# Altium schematic sheet [4] PWM, MOSFETs.SchDoc
size A4; DocumentNumber: 3; SheetNumber: 3; SheetTotal: 10
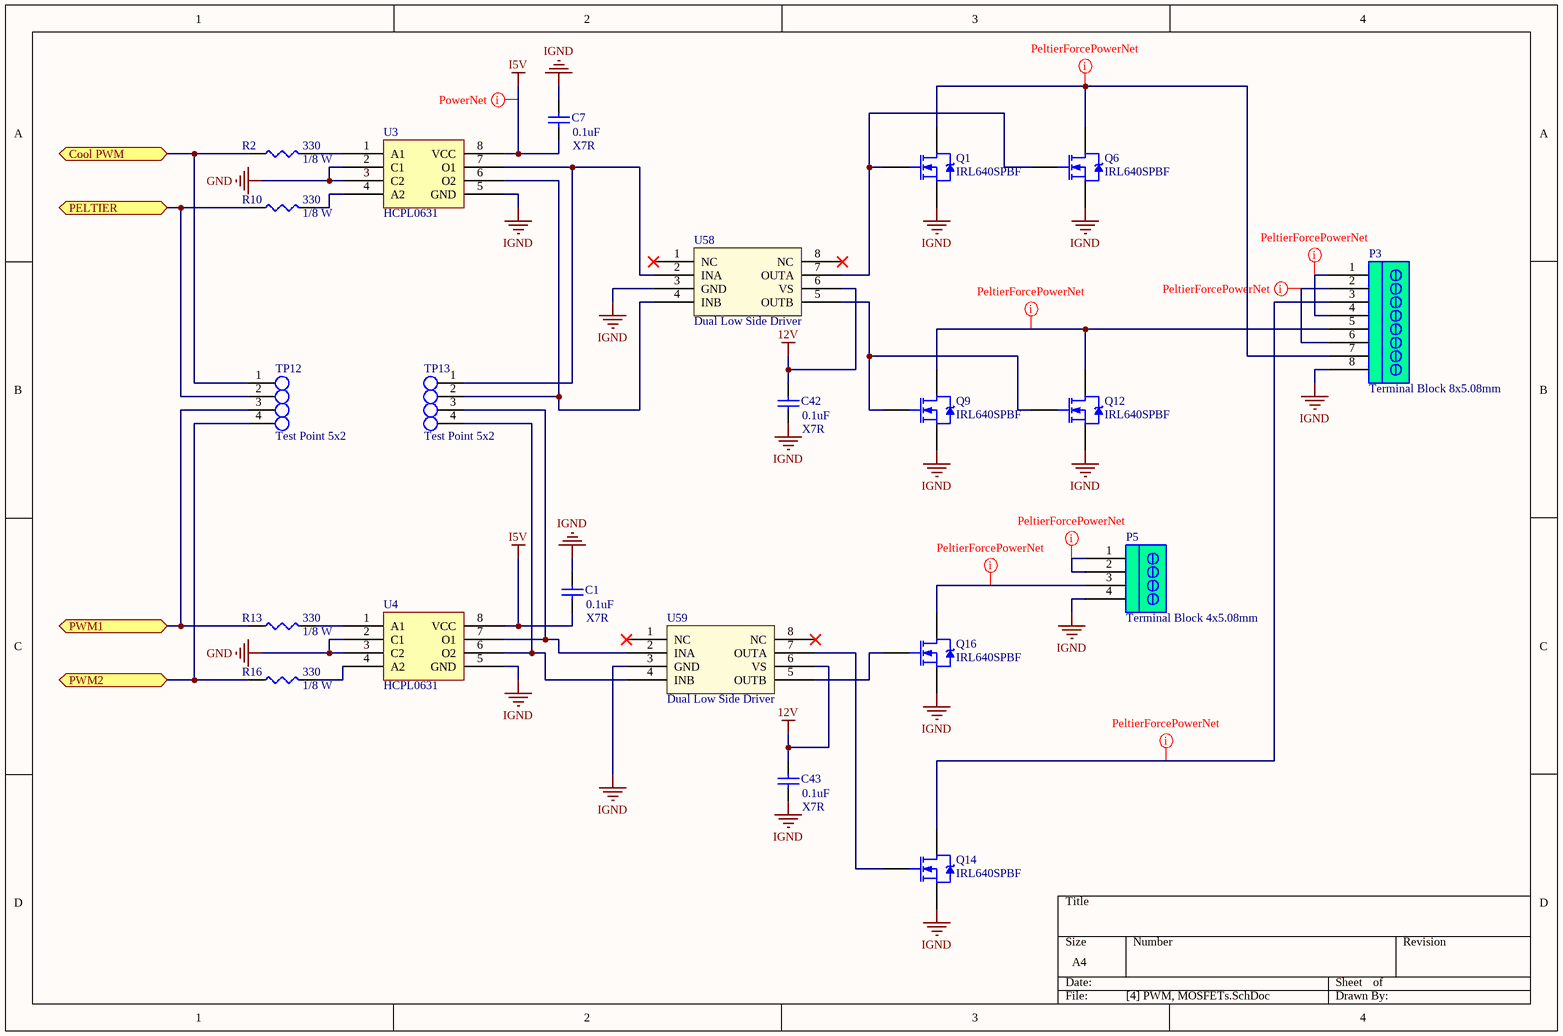
[diagram p0: [4] PWM, MOSFETs.SchDoc]

## Parts
C1  value 0.1uF  Type: X7R  [CAP0805]  (hidden comment: CAP0805 0.1uF X7R)
C7  value 0.1uF  Type: X7R  [CAP0805]  (hidden comment: CAP0805 0.1uF X7R)
C42  value 0.1uF  Type: X7R  [CAP0805]  (hidden comment: CAP0805 0.1uF X7R)
C43  value 0.1uF  Type: X7R  [CAP0805]  (hidden comment: CAP0805 0.1uF X7R)
P3  Terminal Block 8x5.08mm  [SOCKET 8x5.08]
P5  Terminal Block 4x5.08mm  [Socket 4x5.08]
Q1  IRL640SPBF  [TO-263AB]
Q6  IRL640SPBF  [TO-263AB]
Q9  IRL640SPBF  [TO-263AB]
Q12  IRL640SPBF  [TO-263AB]
Q14  IRL640SPBF  [TO-263AB]
Q16  IRL640SPBF  [TO-263AB]
R2  value 330  Rating: 1/8 W  [RES0805]  (hidden comment: RES0805 330R 1%)
R10  value 330  Rating: 1/8 W  [RES0805]  (hidden comment: RES0805 330R 1%)
R13  value 330  Rating: 1/8 W  [RES0805]  (hidden comment: RES0805 330R 1%)
R16  value 330  Rating: 1/8 W  [RES0805]  (hidden comment: RES0805 330R 1%)
TP12  Test Point 5x2  [PG-1.5-13.5-4P-2.54PH]
TP13  Test Point 5x2  [PG-1.5-13.5-4P-2.54PH]
U3  HCPL0631  [SOIC8]
U4  HCPL0631  [SOIC8]
U58  Dual Low Side Driver  [SOIC8]
U59  Dual Low Side Driver  [SOIC8]

## Ports
Cool PWM, PELTIER, PWM1, PWM2

## Nets
12V: C42.2 C43.2 U58.6(VS) U59.6(VS)
GND: U3.2(C1) U3.3(C2) U4.2(C1) U4.3(C2)
I5V: C1.1 C7.1 U3.8(VCC) U4.8(VCC)
IGND: C1.2 C7.2 C42.1 C43.1 P3.8 P5.4 Q1.3(S) Q6.3(S) Q9.3(S) Q12.3(S) Q14.3(S) Q16.3(S) U3.5(GND) U4.5(GND) U58.3(GND) U59.3(GND)
Cool PWM: R2.1 TP12.1 ; port Cool PWM
PELTIER: R10.1 TP12.2 ; port PELTIER
PWM1: R13.1 TP12.3 ; port PWM1
PWM2: R16.1 TP12.4 ; port PWM2
NetP3_1: P3.1 P3.4
NetP3_2: P3.2 P3.6
NetP3_3: P3.3 Q14.2(D)
NetP3_5: P3.5 Q9.2(D) Q12.2(D)
NetP3_7: P3.7 Q1.2(D) Q6.2(D)
NetP5_1: P5.1 P5.2
NetP5_3: P5.3 Q16.2(D)
NetQ1_1: Q1.1(G) Q6.1(G) U58.7(OUTA)
NetQ9_1: Q9.1(G) Q12.1(G) U58.5(OUTB)
NetQ14_1: Q14.1(G) U59.7(OUTA)
NetQ16_1: Q16.1(G) U59.5(OUTB)
NetR2_2: R2.2 U3.1(A1)
NetR10_2: R10.2 U3.4(A2)
NetR13_2: R13.2 U4.1(A1)
NetR16_2: R16.2 U4.4(A2)
NetTP13_1: TP13.1 U3.7(O1) U58.2(INA)
NetTP13_2: TP13.2 U3.6(O2) U58.4(INB)
NetTP13_3: TP13.3 U4.7(O1) U59.2(INA)
NetTP13_4: TP13.4 U4.6(O2) U59.4(INB)

Not connected (* = marked no-connect by the designer): U58 1(NC)* 8(NC)*; U59 1(NC)* 8(NC)*

## Layout directives
net class PeltierForcePowerNet: NetP3_1, NetP3_2, NetP3_3, NetP3_5, NetP3_7, NetP5_1, NetP5_3
net class Undefined: I5V

## Library data of the parts
C1 C7 C42 C43 = CAP0805 0.1uF X7R: Surface-mount ceramic multilayer capacitor; Manufacturer: YAGEO; Manufacturer Part Number: CC0805JRX7R9BB104; Voltage: 50V; Tolerance: 5%; ComponentLink1Description: Datasheet; ComponentLink1URL: http://www.deaha.com/pdf/YAGEO-CC_series.pdf
P3 = Socket_8x5.08_RA_2Wall: Terminal Block Socket Right Angle 8x5.08mm 2-Wall
P5 = Socket_4x5.08_RA_2Wall: Terminal Block Socket Right Angle 4x5.08mm 2-Wall
Q1 Q6 Q9 Q12 Q14 Q16 = IRL640SPBF: HEXFET N-Channel Power MOSFET; Manufacturer: Vishay; Manufacturer Part Number: IRL640SPBF
R2 R10 R13 R16 = RES0805 330R 1%: Think Film Chip resistor; Manufacturer Part Number: RC0805FR-07330RL; Temperature Coefficient: 100ppm/K; Tolerance: 1%; Type: ThickFilm
TP12 TP13 = PG-1.5-13.5-4P-2.54PH
U3 U4 = HCPL0631: 2-channel opto-coupler
U58 U59 = IR4426: IR MOSFET Dual Low Side Driver; Manufacturer: IR; Manufacturer Part Number: IR4426